# Altium schematic sheet main_board.SchDoc: Hall / Main Board
size A4; DocumentNumber: 1; SheetNumber: 1; SheetTotal: 7
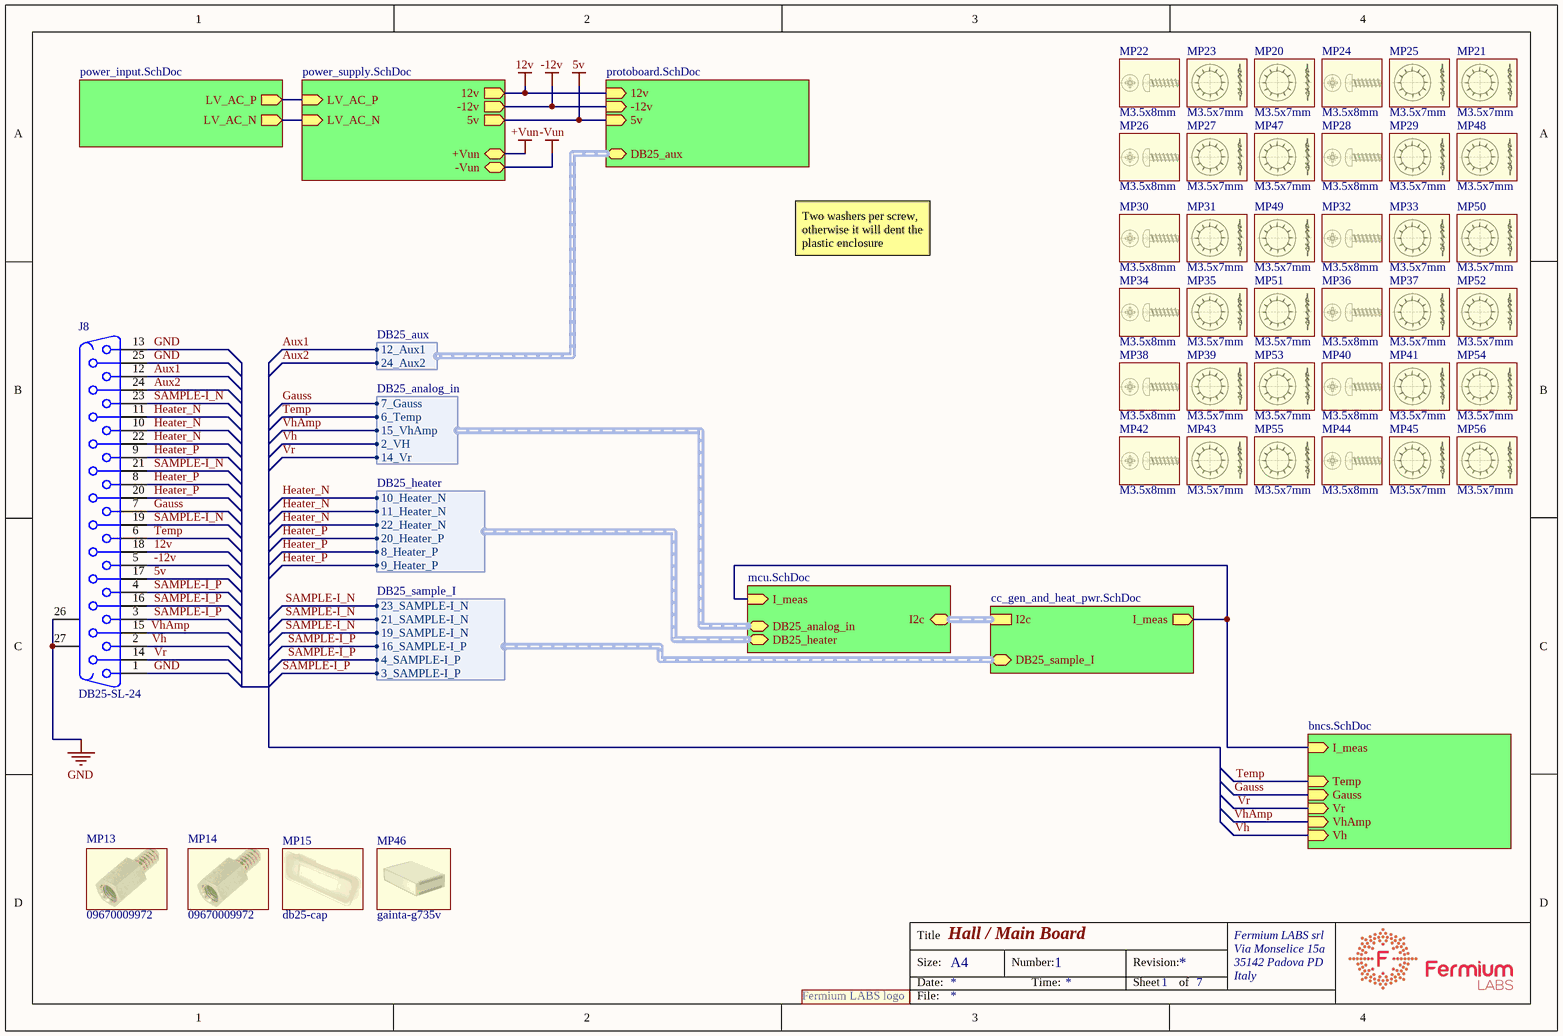
[diagram p0: main_board.SchDoc]

## Parts
J8  Supplier Part Number 1: DB25-SL-24  [DB25]
logo  (no value)  [frm-med]  (no BOM)
MP13  09670009972  (mechanical)
MP14  09670009972  (mechanical)
MP15  db25-cap  (mechanical)
MP20  Size: M3.5x7mm  (hidden comment: rondella-dentata-m3.5_1)  (mechanical)
MP21  Size: M3.5x7mm  (hidden comment: rondella-dentata-m3.5_1)  (mechanical)
MP22  Size: M3.5x8mm  (hidden comment: screw-3.5x8-plasticc_1)  (mechanical)
MP23  Size: M3.5x7mm  (hidden comment: rondella-dentata-m3.5_1)  (mechanical)
MP24  Size: M3.5x8mm  (hidden comment: screw-3.5x8-plasticc_1)  (mechanical)
MP25  Size: M3.5x7mm  (hidden comment: rondella-dentata-m3.5_1)  (mechanical)
MP26  Size: M3.5x8mm  (hidden comment: screw-3.5x8-plasticc_1)  (mechanical)
MP27  Size: M3.5x7mm  (hidden comment: rondella-dentata-m3.5_1)  (mechanical)
MP28  Size: M3.5x8mm  (hidden comment: screw-3.5x8-plasticc_1)  (mechanical)
MP29  Size: M3.5x7mm  (hidden comment: rondella-dentata-m3.5_1)  (mechanical)
MP30  Size: M3.5x8mm  (hidden comment: screw-3.5x8-plasticc_1)  (mechanical)
MP31  Size: M3.5x7mm  (hidden comment: rondella-dentata-m3.5_1)  (mechanical)
MP32  Size: M3.5x8mm  (hidden comment: screw-3.5x8-plasticc_1)  (mechanical)
MP33  Size: M3.5x7mm  (hidden comment: rondella-dentata-m3.5_1)  (mechanical)
MP34  Size: M3.5x8mm  (hidden comment: screw-3.5x8-plasticc_1)  (mechanical)
MP35  Size: M3.5x7mm  (hidden comment: rondella-dentata-m3.5_1)  (mechanical)
MP36  Size: M3.5x8mm  (hidden comment: screw-3.5x8-plasticc_1)  (mechanical)
MP37  Size: M3.5x7mm  (hidden comment: rondella-dentata-m3.5_1)  (mechanical)
MP38  Size: M3.5x8mm  (hidden comment: screw-3.5x8-plasticc_1)  (mechanical)
MP39  Size: M3.5x7mm  (hidden comment: rondella-dentata-m3.5_1)  (mechanical)
MP40  Size: M3.5x8mm  (hidden comment: screw-3.5x8-plasticc_1)  (mechanical)
MP41  Size: M3.5x7mm  (hidden comment: rondella-dentata-m3.5_1)  (mechanical)
MP42  Size: M3.5x8mm  (hidden comment: screw-3.5x8-plasticc_1)  (mechanical)
MP43  Size: M3.5x7mm  (hidden comment: rondella-dentata-m3.5_1)  (mechanical)
MP44  Size: M3.5x8mm  (hidden comment: screw-3.5x8-plasticc_1)  (mechanical)
MP45  Size: M3.5x7mm  (hidden comment: rondella-dentata-m3.5_1)  (mechanical)
MP46  gainta-g735v  (mechanical)
MP47  Size: M3.5x7mm  (hidden comment: rondella-dentata-m3.5_1)  (mechanical)
MP48  Size: M3.5x7mm  (hidden comment: rondella-dentata-m3.5_1)  (mechanical)
MP49  Size: M3.5x7mm  (hidden comment: rondella-dentata-m3.5_1)  (mechanical)
MP50  Size: M3.5x7mm  (hidden comment: rondella-dentata-m3.5_1)  (mechanical)
MP51  Size: M3.5x7mm  (hidden comment: rondella-dentata-m3.5_1)  (mechanical)
MP52  Size: M3.5x7mm  (hidden comment: rondella-dentata-m3.5_1)  (mechanical)
MP53  Size: M3.5x7mm  (hidden comment: rondella-dentata-m3.5_1)  (mechanical)
MP54  Size: M3.5x7mm  (hidden comment: rondella-dentata-m3.5_1)  (mechanical)
MP55  Size: M3.5x7mm  (hidden comment: rondella-dentata-m3.5_1)  (mechanical)
MP56  Size: M3.5x7mm  (hidden comment: rondella-dentata-m3.5_1)  (mechanical)

## Sub-sheets
? = bncs.SchDoc: Temp (in), Gauss (in), I_meas (in), Vr (in), VhAmp (in), Vh (in)
? = mcu.SchDoc: I2c (harness I2c), I_meas (in), DB25_analog_in (harness DB25_analog_in), DB25_heater (harness DB25_heater)
? = power_supply.SchDoc: 12v (out), -12v (out), 5v (out), LV_AC_P (in), LV_AC_N (in), +Vun, -Vun
? = cc_gen_and_heat_pwr.SchDoc: I2c (harness I2c), I_meas (out), DB25_sample_I (harness DB25_sample_I)
? = protoboard.SchDoc: 12v (in), -12v (in), 5v (in), DB25_aux (harness DB25_aux)
? = power_input.SchDoc: LV_AC_P (out), LV_AC_N (out)

## Harnesses
DB25_analog_in: 14_Vr, 15_VhAmp, 2_VH, 6_Temp, 7_Gauss
DB25_heater: 10_Heater_N, 11_Heater_N, 20_Heater_P, 22_Heater_N, 8_Heater_P, 9_Heater_P
DB25_sample_I: 16_SAMPLE-I_P, 19_SAMPLE-I_N, 21_SAMPLE-I_N, 23_SAMPLE-I_N, 3_SAMPLE-I_P, 4_SAMPLE-I_P
DB25_aux: 12_Aux1, 24_Aux2

## Nets
5v: J8.17 ; sheet /5v, sheet /5v
12v: J8.18 ; sheet /12v, sheet /12v
+Vun: sheet /+Vun
-12v: J8.5 ; sheet /-12v, sheet /-12v
-Vun: sheet /-Vun
GND: J8.1 J8.13 J8.25 J8.26(MH1) J8.27(MH2)
Aux1: J8.12 ; sheet /DB25_aux.12_Aux1
Aux2: J8.24 ; sheet /DB25_aux.24_Aux2
Gauss: J8.7 ; sheet /Gauss, sheet /DB25_analog_in.7_Gauss
Heater_N: J8.10 J8.11 J8.22 ; sheet /DB25_heater.10_Heater_N, sheet /DB25_heater.11_Heater_N, sheet /DB25_heater.22_Heater_N
Heater_P: J8.8 J8.9 J8.20 ; sheet /DB25_heater.20_Heater_P, sheet /DB25_heater.8_Heater_P, sheet /DB25_heater.9_Heater_P
SAMPLE-I_N: J8.19 J8.21 J8.23 ; sheet /DB25_sample_I.19_SAMPLE-I_N, sheet /DB25_sample_I.21_SAMPLE-I_N, sheet /DB25_sample_I.23_SAMPLE-I_N
SAMPLE-I_P: J8.3 J8.4 J8.16 ; sheet /DB25_sample_I.16_SAMPLE-I_P, sheet /DB25_sample_I.3_SAMPLE-I_P, sheet /DB25_sample_I.4_SAMPLE-I_P
Temp: J8.6 ; sheet /Temp, sheet /DB25_analog_in.6_Temp
Vh: J8.2 ; sheet /Vh, sheet /DB25_analog_in.2_VH
VhAmp: J8.15 ; sheet /VhAmp, sheet /DB25_analog_in.15_VhAmp
Vr: J8.14 ; sheet /Vr, sheet /DB25_analog_in.14_Vr
(unnamed): sheet /I_meas, sheet /I_meas, sheet /I_meas
(unnamed): sheet /LV_AC_P, sheet /LV_AC_P
(unnamed): sheet /LV_AC_N, sheet /LV_AC_N

## Notes on the sheet
- Two washers per screw, otherwise it will dent the plastic enclosure
- Title
- Size:
- Date:
- A4
- Number:
- Time:
- Revision:
- Sheet
- of
- Fermium LABS srl
- Via Monselice 15a
- 35142 Padova PD
- Italy
- File:
- (in symbol fermiumlabs-logo) Fermium LABS logo

## Library data of the parts
J8 = D Connector 25: d-sub, 25 pins,  Right Angle; Manufacturer: ADAM TECH; Pads: 29 THT; Supplier 1: TME; Manufacturer Part Number: DB25-SL-24; Category: D-Sub connectors
logo = fermiumlabs-logo
MP13 MP14 = 09670009972: Manufacturer: HARTING; Supplier 1: TME; Supplier Part Number 1: 09670009972; Manufacturer Part Number: 09670009972
MP15 = db25-cap: Manufacturer Part Number: 2105-0100-03; Manufacturer: Encitech; Supplier 1: TME; Supplier Part Number 1: DC25-P
MP20 MP21 MP23 MP25 MP27 MP29 MP31 MP33 MP35 MP37 MP39 MP41 MP43 MP45 MP47-MP56 = rondella-dentata-m3.5_1: Manufacturer Part Number: M3.5/BN782 DIN6798J; Manufacturer: BOSSARD; Supplier 1: TME; Supplier Part Number 1: B3.5/BN782
MP22 MP24 MP26 MP28 MP30 MP32 MP34 MP36 MP38 MP40 MP42 MP44 = screw-3.5x8-plasticc_1: Manufacturer Part Number: M3.5X8/BN82428; Manufacturer: BOSSARD; Supplier 1: TME; Supplier Part Number 1: B3.5X8/BN82428
MP46 = gainta-g735v: Manufacturer Part Number: G735V; Manufacturer: GAINTA; Supplier 1: TME; Supplier Part Number 1: G735V